# Altium schematic sheet 06-uSD, Buttons and Buzzer.SchDoc: uSD, Buttons and Buzzer
size A4; Engineer: Juan M Garin; Organization: ESO; Address1: Juan M Garin; DocumentNumber: 6; Revision: 1.0; SheetNumber: 6; SheetTotal: 6
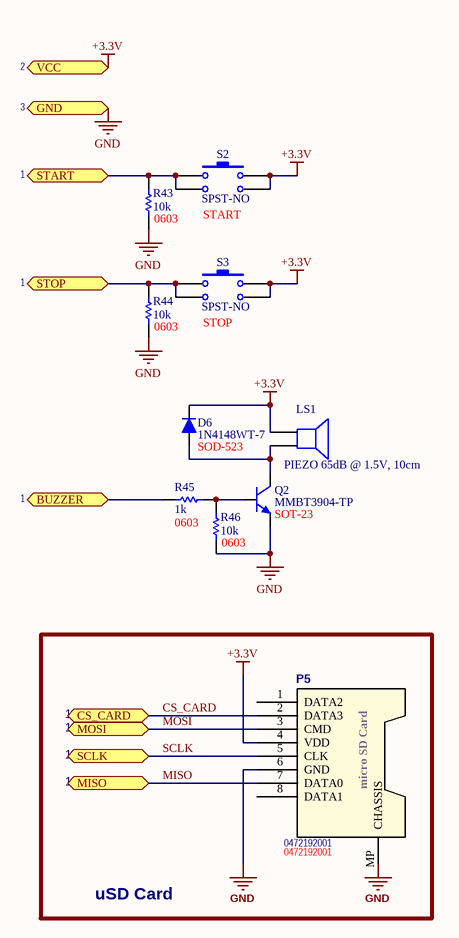
[diagram p0: 06-uSD, Buttons and Buzzer.SchDoc]

## Parts
D6  1N4148WT-7  PackageReference: SOD-523  [SOD523]
LS1  PIEZO 65dB @ 1.5V, 10cm  [PIEZO_XDCR_PKMCS0909E4000-R1]
P5  0472192001  [MICROSD_MOLEX_0472192001]
Q2  MMBT3904-TP  PackageReference: SOT-23  [SOT23-3]
R43  10k  PackageReference: 0603  [R0603]
R44  10k  PackageReference: 0603  [R0603]
R45  1k  PackageReference: 0603  [R0603]
R46  10k  PackageReference: 0603  [R0603]
S2  SPST-NO  Function: START  [BUTTON_D6R90_GREEN]
S3  SPST-NO  Function: STOP  [BUTTON_D6R90_RED]

## Blocks framed on the sheet
uSD Card: P5

## Ports
BUZZER, CS_CARD, GND, MISO, MOSI, SCLK, START, STOP, VCC

## Nets
+3.3V: D6.2(K) LS1.1 P5.4(VDD) S2.3 S2.4 S3.3 S3.4 ; port VCC
GND: P5.6(GND) P5.MP(CHASSIS) Q2.1(E) R43.2 R44.2 R46.2 ; port GND
BUZZER: R45.1 ; port BUZZER
CS_CARD: P5.2(DATA3) ; port CS_CARD
MISO: P5.7(DATA0) ; port MISO
MOSI: P5.3(CMD) ; port MOSI
SCLK: P5.5(CLK) ; port SCLK
START: R43.1 S2.1 S2.2 ; port START
STOP: R44.1 S3.1 S3.2 ; port STOP
NetD6_1: D6.1(A) LS1.2 Q2.3(C)
NetQ2_2: Q2.2(B) R45.2 R46.1

Not connected (* = marked no-connect by the designer): P5 1(DATA2) 8(DATA1)

## Notes on the sheet
- 2
- 3
- 1
- Title
- Size:
- Date:
- A4
- Number:
- Time:
- Revision:
- Sheet
- of
- File:
- (in symbol microSD-114-00841-68) micro SD Card

## Library data of the parts
D6 = DIODE: Manufacturer Part Number: 1N4148WT-7
LS1 = Speaker: Loudspeaker; Manufacturer Part Number: PKMCS0909E4000-R1
P5 = microSD-114-00841-68: Micro SD Card Slot 8-pin Push-In Push-Out; Manufacturer Part Number: 0472192001; PackageReference: 0472192001
Q2 = MMBT3904: TRANS NPN 40V 0.2A SOT-23; Manufacturer Part Number: MMBT3904-TP
R43 R44 R46 = Res1: Resistor; Manufacturer Part Number: RMCF0603FT10K0; Value: 10k
R45 = Res1: Resistor; Manufacturer Part Number: RMCF0603FG1K00; Value: 1k
S2 = SW-PB: Switch; Manufacturer Part Number: D6R50 F1 LFS; PackageReference: SPST-NO
S3 = SW-PB: Switch; Manufacturer Part Number: D6R40 F1 LFS; PackageReference: SPST-NO